# EAGLE design OSO-SWAT-A1-0x (EAGLE 9.4.2)
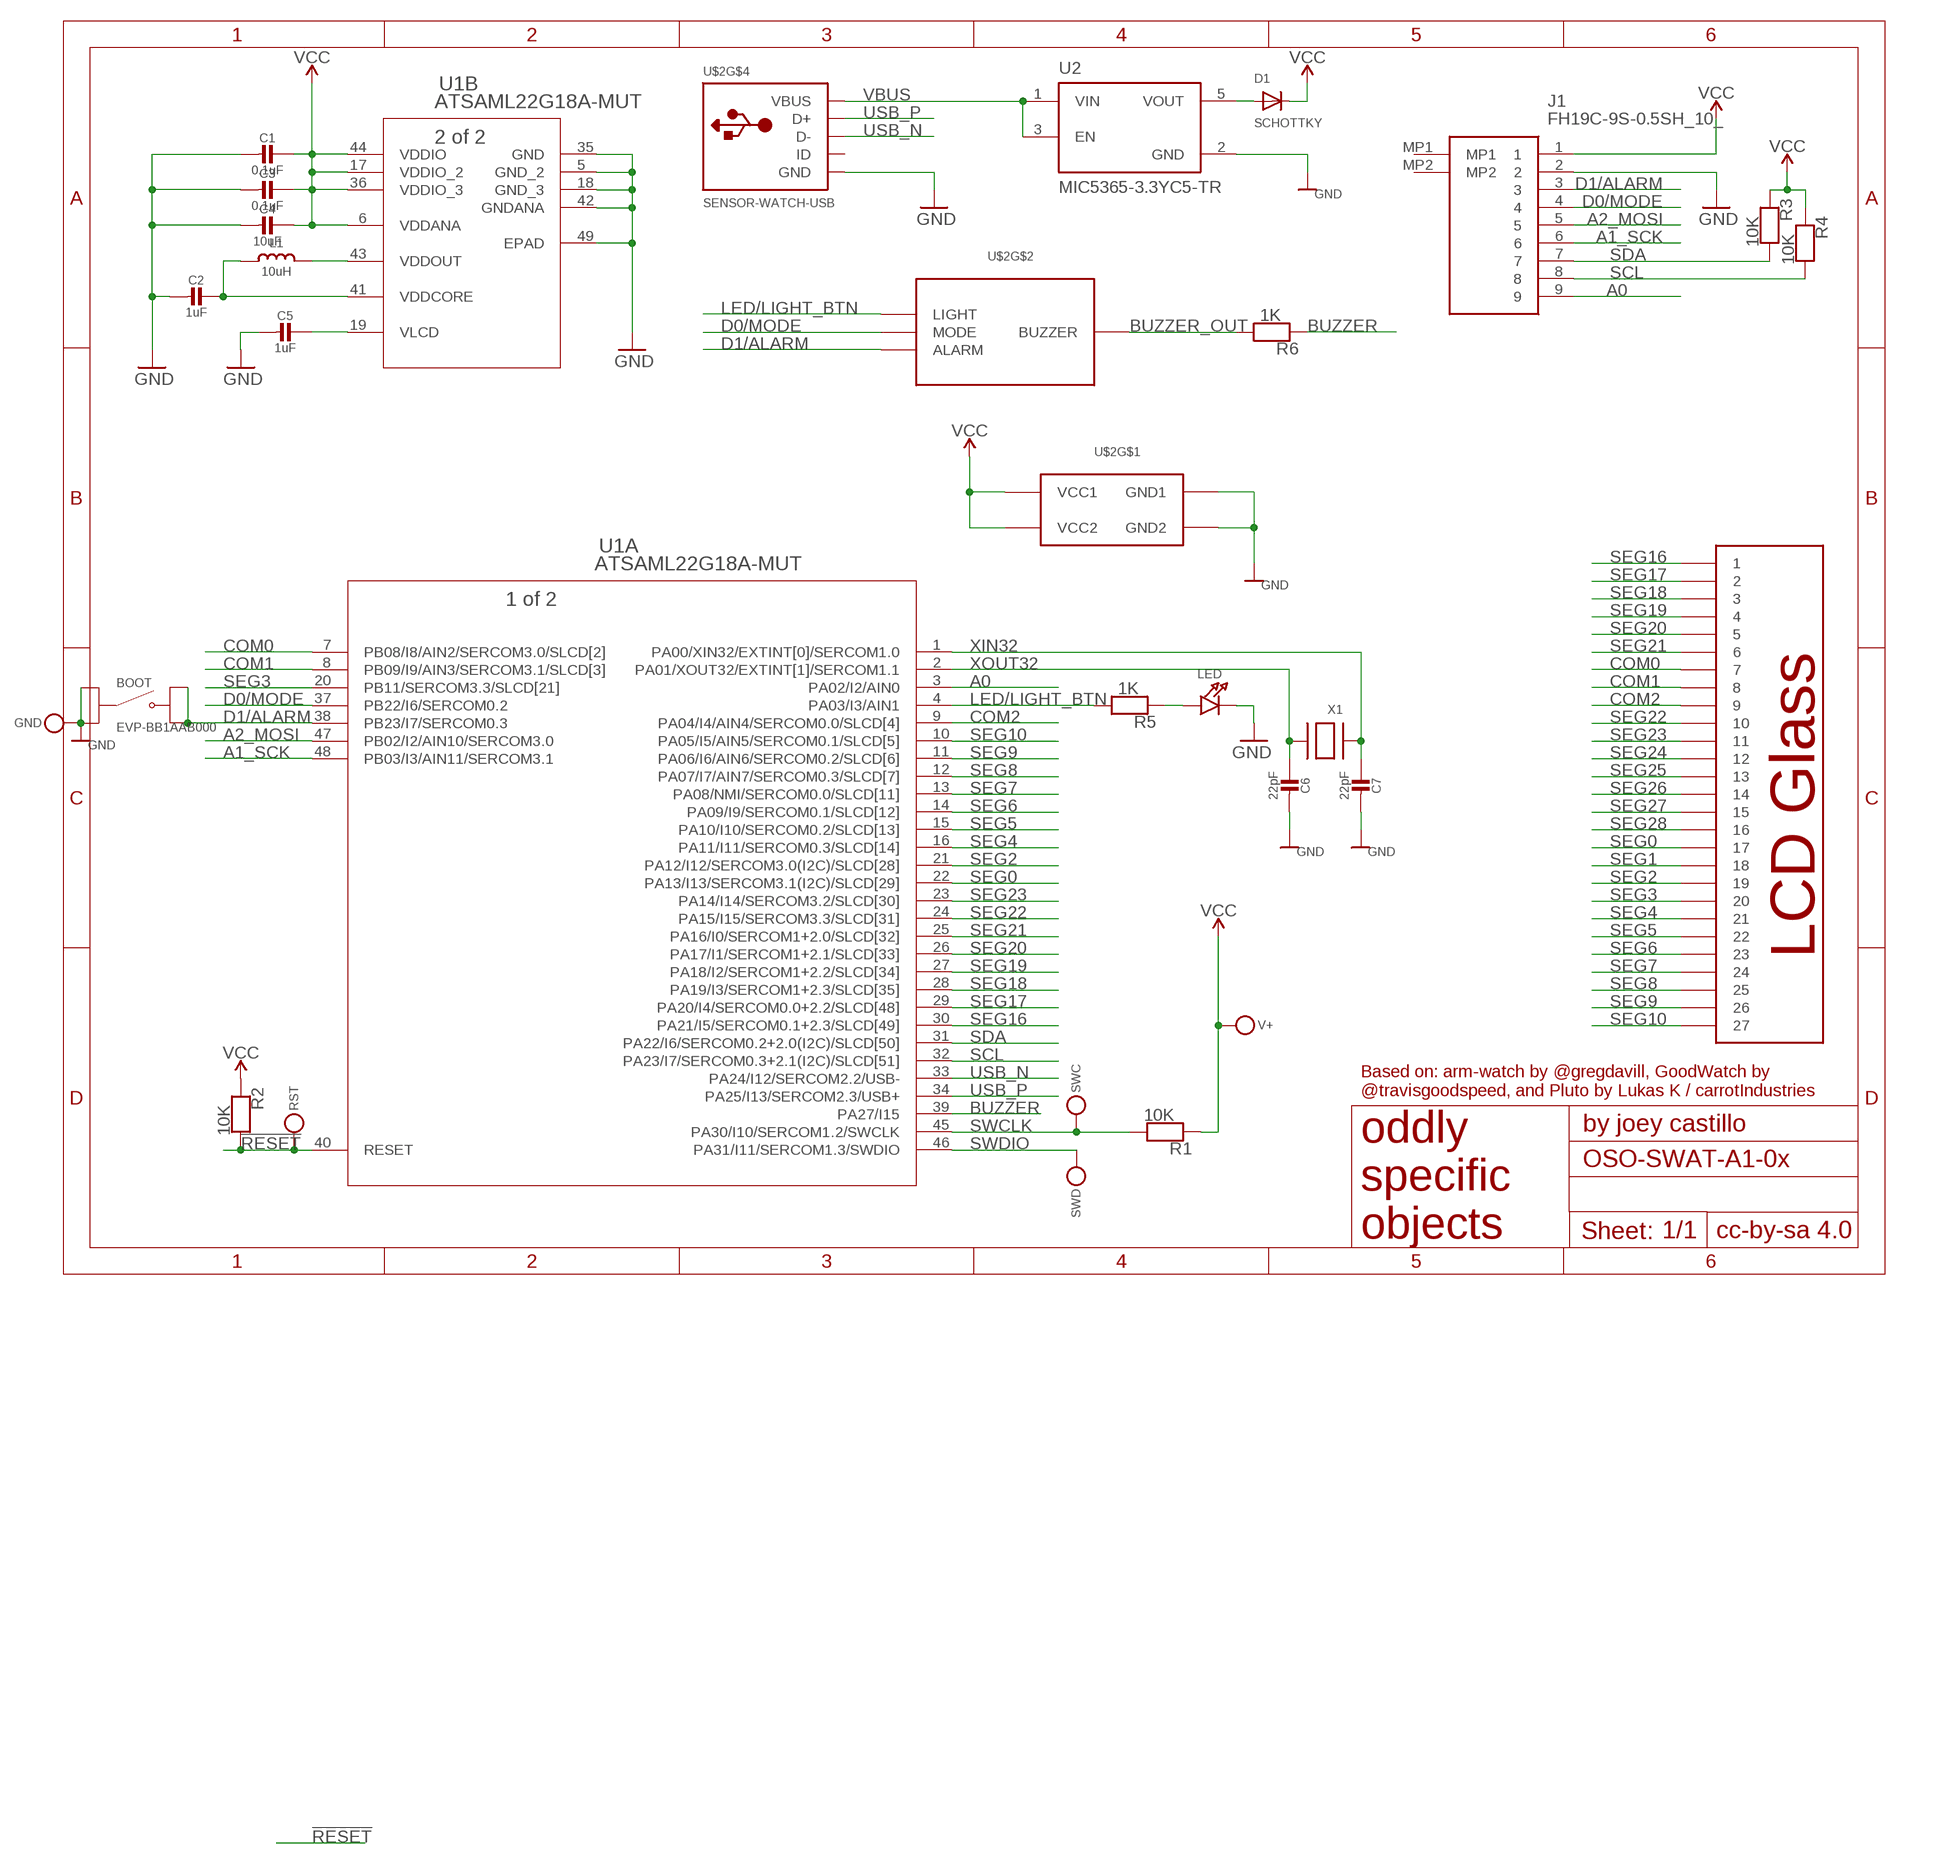
[diagram p0: schematic, sheet 1]

## Parts
BOOT  EVP-BB1AAB000  [SW_EVP-BB1AAB000]
C1  0.1uF  CAP_CERAMIC_0603MP  [_0603MP]
C2  1uF  CAP_CERAMIC_0603MP  [_0603MP]
C3  0.1uF  CAP_CERAMIC_0603MP  [_0603MP]
C4  10uF  CAP_CERAMIC_0603MP  [_0603MP]
C5  1uF  CAP_CERAMIC_0603MP  [_0603MP]
C6  22pF  CAP_CERAMIC_0603MP  [_0603MP]
C7  22pF  CAP_CERAMIC_0603MP  [_0603MP]
D1  SCHOTTKY  DIODESOD-323F  [SOD-323F]
GND  MICROBUILDER_TESTPOINTPAD1MM  [MICROBUILDER_TESTPOINT_PAD_1MM]
J1  FH19C-9S-0.5SH_10_  [FH19C9S05SH10]
L1  10uH  MICROBUILDER_INDUCTOR_0805MP  [MICROBUILDER__0805MP]
LED  LED0805_NOOUTLINE  [CHIPLED_0805_NOOUTLINE]
R1  10K  RESISTOR_0603MP  [_0603MP]
R2  10K  RESISTOR_0402MP  [_0402MP]
R3  10K  RESISTOR_0603MP  [_0603MP]
R4  10K  RESISTOR_0603MP  [_0603MP]
R5  1K  RESISTOR_0603MP  [_0603MP]
R6  1K  RESISTOR_0603MP  [_0603MP]
RST  MICROBUILDER_TESTPOINTPAD1MM  [MICROBUILDER_TESTPOINT_PAD_1MM]
SWC  MICROBUILDER_TESTPOINTPAD1MM  [MICROBUILDER_TESTPOINT_PAD_1MM]
SWD  MICROBUILDER_TESTPOINTPAD1MM  [MICROBUILDER_TESTPOINT_PAD_1MM]
U1  ATSAML22G18A-MUT  [QFN48_7X7MC_MCH]
U2  MIC5365-3.3YC5-TR  [SOT65P210X110-5N]
U$2  SENSOR-WATCH-USB  [CASIO-F91W-OUTLINE-USB]
V+  MICROBUILDER_TESTPOINTPAD1MM  [MICROBUILDER_TESTPOINT_PAD_1MM]
X1  XTAL-3.2X1.5  [XTAL3215]

## Nets
3.3V [power]: D1.A U2.5(VOUT)
!RESET: R2.2 RST.P$1 U1.40(A:RESET)
A0: J1.9 U1.3(A:PA02/I2/AIN0)
A1_SCK: J1.6 U1.48(A:PB03/I3/AIN11/SERCOM3.1)
A2_MOSI: J1.5 U1.47(A:PB02/I2/AIN10/SERCOM3.0)
BUZZER: R6.1 U1.39(A:PA27/I15)
BUZZER_OUT: R6.2 U$2.BUZZER
COM0: U1.7(A:PB08/I8/AIN2/SERCOM3.0/SLCD[2]) U$2.7
COM1: U1.8(A:PB09/I9/AIN3/SERCOM3.1/SLCD[3]) U$2.8
COM2: U1.9(A:PA04/I4/AIN4/SERCOM0.0/SLCD[4]) U$2.9
D0/MODE: J1.4 U1.37(A:PB22/I6/SERCOM0.2) U$2.MODE
D1/ALARM: BOOT.B1 BOOT.B2 J1.3 U1.38(A:PB23/I7/SERCOM0.3) U$2.ALARM
GND [gnd]: BOOT.A1 BOOT.A2 C1.2 C2.2 C3.2 C4.2 C5.2 C6.2 C7.2 GND.P$1 J1.2 LED.C U1.5(B:GND_2) U1.18(B:GND_3) U1.35(B:GND) U1.42(B:GNDANA) U1.49(B:EPAD) U2.2(GND) U$2.GND U$2.GND1 U$2.GND2
LED/LIGHT_BTN: R5.2 U1.4(A:PA03/I3/AIN1) U$2.LIGHT
N$1: LED.A R5.1
SCL: J1.8 R4.2 U1.32(A:PA23/I7/SERCOM0.3+2.1(I2C)/SLCD[51])
SDA: J1.7 R3.2 U1.31(A:PA22/I6/SERCOM0.2+2.0(I2C)/SLCD[50])
SEG0: U1.22(A:PA13/I13/SERCOM3.1(I2C)/SLCD[29]) U$2.17
SEG1: U$2.18
SEG2: U1.21(A:PA12/I12/SERCOM3.0(I2C)/SLCD[28]) U$2.19
SEG3: U1.20(A:PB11/SERCOM3.3/SLCD[21]) U$2.20
SEG4: U1.16(A:PA11/I11/SERCOM0.3/SLCD[14]) U$2.21
SEG5: U1.15(A:PA10/I10/SERCOM0.2/SLCD[13]) U$2.22
SEG6: U1.14(A:PA09/I9/SERCOM0.1/SLCD[12]) U$2.23
SEG7: U1.13(A:PA08/NMI/SERCOM0.0/SLCD[11]) U$2.24
SEG8: U1.12(A:PA07/I7/AIN7/SERCOM0.3/SLCD[7]) U$2.25
SEG9: U1.11(A:PA06/I6/AIN6/SERCOM0.2/SLCD[6]) U$2.26
SEG10: U1.10(A:PA05/I5/AIN5/SERCOM0.1/SLCD[5]) U$2.27
SEG16: U1.30(A:PA21/I5/SERCOM0.1+2.3/SLCD[49]) U$2.1
SEG17: U1.29(A:PA20/I4/SERCOM0.0+2.2/SLCD[48]) U$2.2
SEG18: U1.28(A:PA19/I3/SERCOM1+2.3/SLCD[35]) U$2.3
SEG19: U1.27(A:PA18/I2/SERCOM1+2.2/SLCD[34]) U$2.4
SEG20: U1.26(A:PA17/I1/SERCOM1+2.1/SLCD[33]) U$2.5
SEG21: U1.25(A:PA16/I0/SERCOM1+2.0/SLCD[32]) U$2.6
SEG22: U1.24(A:PA15/I15/SERCOM3.3/SLCD[31]) U$2.10
SEG23: U1.23(A:PA14/I14/SERCOM3.2/SLCD[30]) U$2.11
SEG24: U$2.12
SEG25: U$2.13
SEG26: U$2.14
SEG27: U$2.15
SEG28: U$2.16
SWCLK: R1.2 SWC.P$1 U1.45(A:PA30/I10/SERCOM1.2/SWCLK)
SWDIO: SWD.P$1 U1.46(A:PA31/I11/SERCOM1.3/SWDIO)
USB_N: U1.33(A:PA24/I12/SERCOM2.2/USB-) U$2.USB_N(D-)
USB_P: U1.34(A:PA25/I13/SERCOM2.3/USB+) U$2.USB_P(D+)
VBUS: U2.1(VIN) U2.3(EN) U$2.VBUS
VCC [power]: C1.1 C3.1 C4.1 D1.C J1.1 R1.1 R2.1 R3.1 R4.1 U1.6(B:VDDANA) U1.17(B:VDDIO_2) U1.36(B:VDDIO_3) U1.44(B:VDDIO) U$2.VCC1 U$2.VCC2 V+.P$1
VDDCORE: C2.1 L1.1 U1.41(B:VDDCORE)
VDDOUT: L1.2 U1.43(B:VDDOUT)
VLCD: C5.1 U1.19(B:VLCD)
XIN32: C7.1 U1.1(A:PA00/XIN32/EXTINT[0]/SERCOM1.0) X1.P$1
XOUT32: C6.1 U1.2(A:PA01/XOUT32/EXTINT[1]/SERCOM1.1) X1.P$2
Unconnected: J1.MP1 J1.MP2 U$2.USB_ID(ID)

## Notes on the sheet
- Based on: arm-watch by @gregdavill, GoodWatch by 
  @travisgoodspeed, and Pluto by Lukas K / carrotIndustries

## Library data of the parts
BOOT = EVP-BB1AAB000:EVP-BB1AAB000: SWITCH TACTILE SPST-NO 0.02A 15V; DESCRIPTION: Tactile Switch SPST-NO Top Actuated Surface Mount; DIGI-KEY_PART_NUMBER: P124390CT-ND; MF: Panasonic Electronic Components; MP: EVP-BB1AAB000; PACKAGE: None; PURCHASE-URL: https://pricing.snapeda.com/search/part/EVP-BB1AAB000/?ref=eda
C1-C7 = microbuilder:CAP_CERAMIC: Ceramic Capacitors For new designs, use the packages preceded by an '_' character since they are more reliable: The following footprints should be used on most boards: _0402 - Standard footprint for regular board layouts _0603 - Standard footprint for regular board layouts _0805 - Standard footprint for regular board layouts _1206 - Standard footprint for regular board layouts For extremely tight-pitch boards where space is at a premium, the following 'micro-pitch' footprints can be used (smaller pads, no silkscreen outline, etc.): _0402MP - Micro-pitch footprint for very dense/compact boards _0603MP - Micro-pitch footprint for very dense/compact boards _0805MP - Micro-pitch footprint for very dense/compact boards _1206MP - Micro-pitch footprint for very dense/compact boards
D1 = adafruit:DIODE: Diode SMADIODE - SMA Surface Mount Package 20V 1A Schottky Diode Digikey: 641-1014-6-ND DO-1N4148 - Through Hole Small Current Diode SOD-123 20V 1 A (.5mV Vf) Schottky Diode - Digikey: MBRX120TPMSCT-ND SOD-323 10V 570mA (.38mV Vf, 3ns) Schottky Diode - Digikey: ZLLS410CT-ND SOD-523 30V 30mA Schottky Diode (RB751S-40TE61) - Digikey: RB751S-40TE61CT-ND SOT23-R/W - SOT23 Package (R = Solder Paste/Reflow Ovens, W = Hand-Soldering) BAT54Film 40V 300mA - Digikey: 497-7162-1-ND
GND RST SWC SWD V+ = Adafruit Feather M0 Express:MICROBUILDER_TESTPOINT: Test Point Various test points for characterisation and PCB testing TESTPOINT_SMT - Compact Surface Mount Test Point [Digikey: 5016KTR-ND]
J1 = FH19C-9S-0.5SH:FH19C-9S-0.5SH_10_: CONN FFC BOTTOM 9POS 0.50MM R/A Source: Datasheet <https://componentsearchengine.com/Datasheets/1/FH19C-9S-0.5SH(10).pdf>; DESCRIPTION: CONN FFC BOTTOM 9POS 0.50MM R/A; HEIGHT: 1mm; MANUFACTURER_NAME: Hirose; MANUFACTURER_PART_NUMBER: FH19C-9S-0.5SH(10); MOUSER_PART_NUMBER: 798-FH19C9S05SH10; MOUSER_PRICE-STOCK: https://www.mouser.co.uk/ProductDetail/Hirose-Connector/FH19C-9S-05SH10?qs=vnk2wBG9e15bX8eK%2FvDSMA%3D%3D
L1 = Adafruit 3.5in 480x320 FeatherWing:MICROBUILDER_INDUCTOR: Inductors 0603: 10nH Ceramic Inductor - microwire antenna/RF (Digikey: 712-1434-2-ND) 0805: 560nH Ceramic Inductor - RF (Digikey: 553-1047-1-ND) 270nH Ceramic Inductor - Q = 40@250MHz, +-5%, 1 Ohm DC Resistance (Digikey: 535-10506-2-ND) 1007 (2518 Metric) SMT: 10µH 10% 250mOhm 820mA 1007 Inductor (Digikey: 587-2189-1-ND) 22µH 10% 500mOhm 580mA 1007 Inductor (Digikey: 587-2190-1-ND) 47µH 10% 950mOhm 420mA 1007 Inductor (Digikey: 587-2191-1-ND) 47µH 5% 100mOhm 1A 1008 Inductor (Digikey: 732-1816-1-ND) 5.0x5.0mm (Taiyo Yuden NR5040 Series) 6.8µH 20% 2.3A 64mOhm Inductor (Digikey: 587-2374-2-ND) 5.0x5.0mm (TDK VLC5045 Series) 4.7µH 20% 3.3A 34mOhm Inductor (Digikey: 445-6526-1-ND) 6.8µH 20% 2.7A 46mOhm Inductor (Digikey: 445-6527-1-ND) 6.0x6.0mm (TDK VLC6045 Series) 4.7µH 20% 3.8A 27mOhm Inductor (Digikey: 445-6538-2-ND) 6.8µH 20% 3A 41mOhm Inductor (Digikey: 445-6540-1-ND) 6.2µH 30% 2.2A 45mOhm Inductor (Digikey: SRR5028-6R2YCT-ND) - Not TDK VLC6045 but footprint should match 6.0x6.0mm (TDK SLF6045 Series) 6.8uH 30% 2A 33mOhm Inductor (Digikey: 445-4572-1-ND, Mouser: 810-SLF645T6R8N2R0PF) 6.0x6.0mm (Sumida CDRH5D28 Series) 6.2uH 30% 1.8A 45mOhm Inductor (Digikey: 308-1542-1-ND) Taiyo Yuden NR3015T2R2M - 2.2uH 20% 1.5A (Digikey: 587-1648-2-ND, Mouser: 963-NR3015T2R2M) - Used with TI TPS62172 CoilCraft RFID Transponder Coil - MA5532-AE (For use with AS3935 Lightning Sensor) Taiyo Yuden NRH2412T2R2MNGH - 2.2uH 20% 1AA (Digikey: 587-3443-1-ND) - Used with TI LM3671 Vishay IHLP 1.0uH Molded Inductor - 24mOhm DCR, 5A, +/-20%, -55°C-125°C (Digikey: 541-1319-1-ND)
LED = My Stuff:LED: LED 0603 - 0603 Surface Mount Package 2mA: Green LED - Low Power (3.9mcd, 2ma, 1.7Vf) - Digikey: 475-2709-2-ND Orange LED - Low Power (9.8mcd, 2ma, 1.8Vf) - Digikey: 475-1194-2-ND Red LED - Low Power (5mcd, 2ma, 1.8Vf) - Digikey: 475-1195-2-ND Yellow LED - Low Power (7mcd, 2ma, 1.8Vf) - Digikey: 475-1196-2-ND 5mA: Blue LED - Low Power (17mcd, 5ma, 2.9Vf) - Digikey: LNJ937W8CRACT-ND 0805 - 0805 Surface Mount Package 2mA: Red LED (8.8mcd, 2mA, 1.8Vf, Clear) - Low Power [Digikey: 475-2510-1-ND] Green LED (5mcd, 2mA, 1.8Vf, Clear) - Low Power [Digikey: 475-2730-1-ND] Yellow LED (11.3mcd, 2mA, 1.8Vf, Clear) - Low Power [Digikey: 475-2555-1-ND] 20mA: Red LED (104mcd, 20mA, Diffused) - LS R976 [Digikey: 475-1278-6-ND] Red LED (12mcd, 20mA, 2.0Vf, Clear) - APT2012EC [Digikey: 754-1128-1-ND] Green LED (15mcd, 20mA, 2.2Vf, Clear) - APT2012GC [Digikey: 754-1131-1-ND] Orange LED (160mcd, 20mA, 2.1Vf, Clear) - APT2012SECK [Digikey: 754-1130-1-ND] 1206 - 1206 Surface Mount Package Green LED (26mcd, 20mA, Diffused) - LG N971 [Digikey: 475-1407-6-ND] Red LED (15mcd, 20mA, Diffused) - LH N974 [Digikey: 475-1416-6-ND] Cree - Cree High-Power Surface Mount LEDs XPEBWT-L1-0000-00D50 - White 111lm 350mA 2.9Vf 6200K 110° XTEAWT-00-0000-00000LEE3 - White 114lm 350mA 2.85Vf 5000K 115° Everlight - Everlight 45-21 Series Surface Mount LEDs 45-21/QK2C-B2832AC2CB2/2T - Warm White 2000mcd 20mA 3.25Vf 3050K 120° 45-21/LK2C-B38452C4CB2/2T - Nuetral White 2000mcd 20mA 3.25Vf 4150K 120° 45-21/LK2C-B50634C6CB2/2T - Cold White 2200mcd 20mA 3.25Vf 5650K 120° PLCC2 Reverse Mount LS T77K-J1L2-1-0-2-R18-Z - Red 11.25mcd 2mA 1.8Vf 630nm 120° LO T77K-L1M2-24-Z - Orange 19.6mcd 2mA 1.8Vf 606nm 120° LY T77K-K2M1-26-Z - Yellow 15.7mcd 2mA 1.8Vf 587nm 120°
R1-R6 = microbuilder:RESISTOR: Resistors For new designs, use the packages preceded by an '_' character since they are more reliable: The following footprints should be used on most boards: _0402 - Standard footprint for regular board layouts _0603 - Standard footprint for regular board layouts _0805 - Standard footprint for regular board layouts _1206 - Standard footprint for regular board layouts For extremely tight-pitch boards where space is at a premium, the following 'micro-pitch' footprints can be used (smaller pads, no silkscreen outline, etc.): _0402MP - Micro-pitch footprint for very dense/compact boards _0603MP - Micro-pitch footprint for very dense/compact boards _0805MP - Micro-pitch footprint for very dense/compact boards _1206MP - Micro-pitch footprint for very dense/compact boards
U1 = ATSAML22G18A-MUT:ATSAML22G18A-MUT; BUILT_BY: EMA_Molly; COPYRIGHT: Copyright (C) 2018 Accelerated Designs. All rights reserved; MANUFACTURER_PART_NUMBER: ATSAML22G18A-MUT; SOURCELIBRARY: Microchip_2019-08-23_25; VENDOR: Microchip
U2 = MIC5365-3.3YC5-TR:MIC5365-3.3YC5-TR: Linear Voltage Regulator IC 1 Output 150mA SC-70-5; DESCRIPTION: Linear Voltage Regulator IC 1 Output 150mA SC-70-5; DIGI-KEY_PART_NUMBER: 576-3193-1-ND; MF: Microchip; MP: MIC5365-3.3YC5-TR; PACKAGE: SC-70-5 Microchip; PURCHASE-URL: https://pricing.snapeda.com/search/part/MIC5365-3.3YC5-TR/?ref=eda
U$2 = My Stuff:SENSOR-WATCH-USB
X1 = adafruit:XTAL: Low cost SMT crystals, no capacitors included http://www.ladyada.net/library/eagle

## Net classes
0 default: width 0.102 mm
1 power: width 0.254 mm
2 gnd: width 0.254 mm

## Board
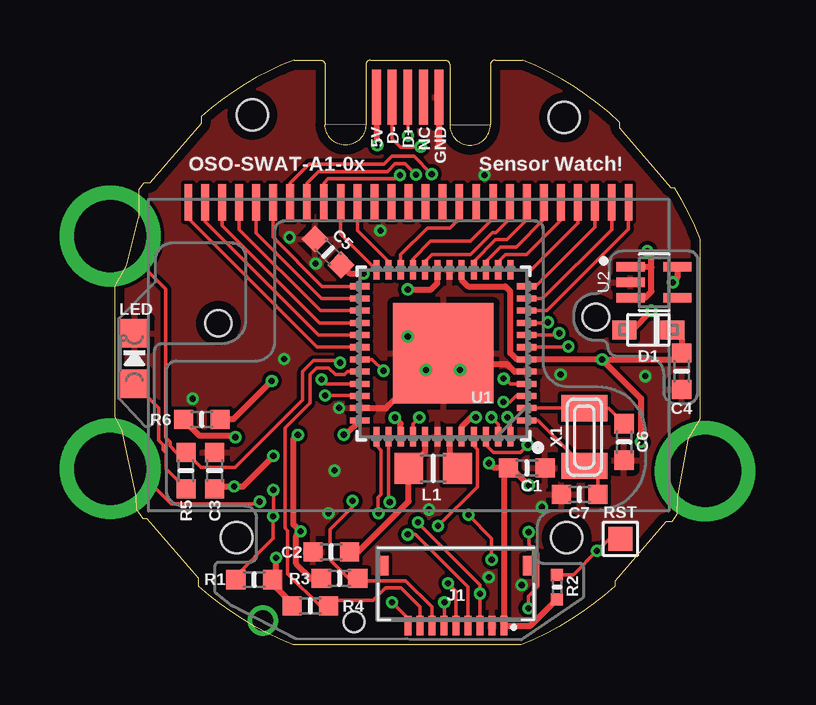
[diagram p1: board, top side]
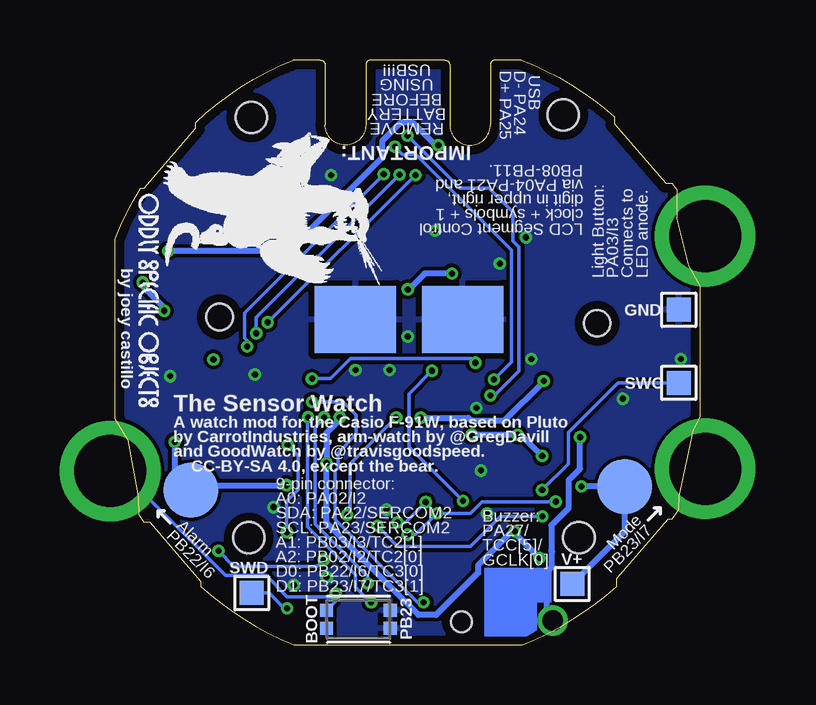
[diagram p2: board, bottom side, seen from below]

Size 24.4 x 24.38 mm. Coordinates in mm from the lower left corner, seen from the top.
Copper layers (1*16): Top 0.035559375mm / dielectric 1.6mm / Bottom 0.035559375mm
Design rules "oshpark-2layer *": minimum track width 6mil, minimum drill 10mil, track to track 6mil, track to pad 6mil, pad to pad 6mil, via to via 6mil, smd to smd 6mil, copper to edge 15mil, drill to drill 6mil, minimum pad ring 5mil, minimum via ring 5mil, stop-mask expansion 2.5mil, vias tented up to drill 10mil, thermal gap 10mil

### Footprints (pad centres in the part's own frame; a part is rotated, then mirrored left to right if it is on the bottom)
SW_EVP-BB1AAB000 = smd 0.55 x 0.55: A1 -1.325,0.375; A2 -1.325,-0.375; B1 1.325,0.375; B2 1.325,-0.375
_0603MP = smd 0.8 x 0.8: 1 -0.762,0; 2 0.762,0
SOD-323F = smd 1 x 0.8: A -1,0; C 1,0
MICROBUILDER_TESTPOINT_PAD_1MM = smd 1 x 1: P$1 0,0
FH19C9S05SH10 = smd 0.3 x 0.8: 1 -2,2.5; 2 -1.5,2.5; 3 -1,2.5; 4 -0.5,2.5; 5 0,2.5; 6 0.5,2.5; 7 1,2.5; 8 1.5,2.5; 9 2,2.5 | smd 0.4 x 0.8: MP1 -3,0; MP2 3,0
MICROBUILDER__0805MP = smd 1.2 x 1.3: 1 -1.016,0; 2 1.016,0
CHIPLED_0805_NOOUTLINE = smd 1.2 x 1.2: A 0,-1.05; C 0,1.05
_0402MP = smd 0.5 x 0.5: 1 -0.508,0; 2 0.508,0
QFN48_7X7MC_MCH = smd 0.813 x 0.254: 1 -3.48,2.794; 2 -3.48,2.286; 3 -3.48,1.778; 4 -3.48,1.27; 5 -3.48,0.762; 6 -3.48,0.254; 7 -3.48,-0.254; 8 -3.48,-0.762; 9 -3.48,-1.27; 10 -3.48,-1.778; 11 -3.48,-2.286; 12 -3.48,-2.794; 25 3.48,-2.794; 26 3.48,-2.286; 27 3.48,-1.778; 28 3.48,-1.27; 29 3.48,-0.762; 30 3.48,-0.254; 31 3.48,0.254; 32 3.48,0.762; 33 3.48,1.27; 34 3.48,1.778; 35 3.48,2.286; 36 3.48,2.794 | smd 0.254 x 0.813: 13 -2.794,-3.48; 14 -2.286,-3.48; 15 -1.778,-3.48; 16 -1.27,-3.48; 17 -0.762,-3.48; 18 -0.254,-3.48; 19 0.254,-3.48; 20 0.762,-3.48; 21 1.27,-3.48; 22 1.778,-3.48; 23 2.286,-3.48; 24 2.794,-3.48; 37 2.794,3.48; 38 2.286,3.48; 39 1.778,3.48; 40 1.27,3.48; 41 0.762,3.48; 42 0.254,3.48; 43 -0.254,3.48; 44 -0.762,3.48; 45 -1.27,3.48; 46 -1.778,3.48; 47 -2.286,3.48; 48 -2.794,3.48 | smd 4.191 x 4.191: 49 0,0
SOT65P210X110-5N = smd 1.17 x 0.4: 1 -0.97,0.65; 2 -0.97,0; 3 -0.97,-0.65; 4 0.97,-0.65; 5 0.97,0.65
CASIO-F91W-OUTLINE-USB = smd 0.326 x 1.52: 1 -9.148,6.25; 2 -8.442,6.25; 3 -7.736,6.25; 4 -7.03,6.25; 5 -6.324,6.25; 6 -5.618,6.25; 7 -4.912,6.25; 8 -4.206,6.25; 9 -3.5,6.25; 10 -2.794,6.25; 11 -2.088,6.25; 12 -1.382,6.25; 13 -0.676,6.25; 14 0.03,6.25; 15 0.736,6.25; 16 1.442,6.25; 17 2.148,6.25; 18 2.854,6.25; 19 3.56,6.25; 20 4.266,6.25; 21 4.972,6.25; 22 5.678,6.25; 23 6.384,6.25; 24 7.09,6.25; 25 7.796,6.25; 26 8.502,6.25; 27 9.208,6.25 | drill 3 pad 4.2: ALARM 12.4,-4.95; LIGHT -12.4,4.85; MODE -12.4,-4.85 | drill 0.85 pad 1.2: BUZZER -6.045,-11.176 | smd 0.37 x 2.3: GND 1.3,10.644; USB_ID 0.65,10.644; USB_N -0.65,10.644; USB_P 0,10.644; VBUS -1.3,10.644 | smd 3.404 x 2.794 bottom: GND1 -2.286,1.372; GND2 2.184,1.372 | smd 2.286 x 2.286 bottom: VCC1 -9.042,-5.588; VCC2 9.042,-5.74 | hole 0.85: -2.235,-11.227 | hole 1.1: -7.899,1.219; 7.849,1.473 | hole 1.3: -6.477,9.906; 6.528,9.804; 6.629,-7.722; -7.137,-7.722
XTAL3215 = smd 1.1 x 1.9: P$1 1.2,0; P$2 -1.2,0

### Placement (x,y rotation side)
BOOT  14.26,1.06 180 bottom
C1  17.17,7.37 0 top
C2  9.01,3.87 180 top
C3  4.15,7.26 90 top
C4  23.62,11.4 270 top
C5  8.88,16.38 135 top
C6  21.22,8.45 270 top
C7  19.36,6.27 180 top
D1  22.23,13.13 0 top
GND  0.9,13.96 0 bottom
J1  14.21,3.3 180 top
L1  13.25,7.35 0 top
LED  0.81,11.93 0 top
R1  5.8,2.71 180 top
R2  18.42,2.41 90 top
R3  9.36,2.76 0 top
R4  8.14,1.62 0 top
R5  2.95,7.26 90 top
R6  3.61,9.39 180 top
RST  21.06,4.41 0 top
SWC  0.9,10.92 0 bottom
SWD  18.7,2.15 0 bottom
U1  13.69,12.15 180 top
U2  22.46,15.11 0 top
U$2  12.2,12.19 0 top
U$5  [OSO_BEAR_250X360MIL_1000DPI]  17.79,18.15 270 bottom
U$6  [OSO_WORDMARK_ONELINE_350MIL_1000DPI]  22.99,14.34 270 bottom
V+  5.34,2.53 0 bottom
X1  19.57,8.66 270 top

### Tracks (layer width: path | path; a pad name or v marks a point on that pad's centre or on a via)
3.3V  (via drill 0.25)
  Top 0.254: U2.5 23.43,15.29 v23.25,15.11 | D1.A 21.56,13.13 v22.36,13.92
  Bottom 0.254: v22.36,13.92 22.36,14.07 23.25,14.95 v23.25,15.11
!RESET  (via drill 0.25)
  Top 0.152: U1.40 12.42,9.2 v12.68,9.47 | v14.73,5.41 15.7,4.44 v15.7,3.54 | RST.P$1 20.6,4.41 v20.09,3.91 19.1,2.91 R2.2
  Bottom 0.152: v12.68,9.47 14.61,7.54 14.61,5.52 v14.73,5.41 | v15.7,3.54 15.97,3.27 19.45,3.27 v20.09,3.91
A0  (via drill 0.25)
  Top 0.152: v11.54,1.77 12.21,1.1 J1.9 | v16.19,10.12 16.46,10.12 16.71,10.37 U1.3
  Bottom 0.152: v16.19,10.12 14.89,10.12 14.35,9.58 14.35,8.76 15.11,7.99 15.11,7.37 15.23,7.24 15.23,5.22 11.79,1.77 v11.54,1.77
A1_SCK  (via drill 0.25)
  Top 0.152: U1.48 16.48,9.32 16.35,9.45 v16.35,9.48 | v13.72,1.77 13.72,0.81 J1.6
  Bottom 0.152: v16.35,9.48 16.38,9.46 16.38,4.91 14.38,2.91 14.38,2.38 13.77,1.77 v13.72,1.77
A2_MOSI  (via drill 0.25)
  Top 0.152: J1.5 14.21,2.23 v13.88,2.56 | v15.69,9.48 15.69,9.45 15.97,9.18 U1.47
  Bottom 0.152: v13.88,2.56 13.88,2.84 16.07,5.03 16.07,9.07 15.69,9.45 v15.69,9.48
BUZZER  (via drill 0.25)
  Top 0.254: U1.39 11.91,9.22 v11.66,9.46 | v6.53,11 4.92,9.39 R6.1
  Bottom 0.254: v11.66,9.46 9.67,9.46 9.55,9.34 8.16,9.34 6.53,10.97 v6.53,11
BUZZER_OUT  (via drill 0.25)
  Top 0.254: v5.01,8.65 4.96,8.71 3.51,8.71 2.85,9.37 R6.2
  Bottom 0.254: U$2.BUZZER 6.41,1.26 6.41,3.02 6.18,3.24 6.18,3.88 6.22,3.92 6.22,4.96 5.5,5.69 5.5,6.85 5.01,7.33 v5.01,8.65
COM0  (via drill 0.25)
  Top 0.152: U1.7 18.87,12.4 v18.89,12.43 | v13.2,19.62 12.46,20.37 11.55,20.37 11.22,20.04 8.09,20.04 7.29,19.24 U$2.7
  Bottom 0.152: v13.2,19.62 19,13.82 19,12.78 18.89,12.68 v18.89,12.43
COM1  (via drill 0.25)
  Top 0.152: U1.8 18.44,12.91 v18.52,12.98 | v12.54,19.6 12.08,20.06 11.68,20.06 11.35,19.73 8.48,19.73 7.99,19.25 U$2.8
  Bottom 0.152: v18.52,12.98 18.52,13.23 18.52,13.24 18.52,13.64 15.96,16.21 15.93,16.21 v12.54,19.6
COM2  (via drill 0.25)
  Top 0.152: U1.9 18.02,13.42 v18.04,13.44 | v11.88,19.58 11.72,19.43 8.88,19.43 8.7,19.25 U$2.9
  Bottom 0.152: v11.88,19.58 18.01,13.44 v18.04,13.44
D0/MODE  (via drill 0.25)
  Top 0.152: J1.4 14.71,2.41 12.53,4.59 v12.2,4.59 | v10.98,5.48 10.96,5.5 10.96,6.14 11.09,6.27 11.09,8.11 10.89,8.31 U1.37 | v6.03,5.96 5.93,5.87 2.33,5.87 0.86,7.34 U$2.MODE
  Bottom 0.152: v12.2,4.59 11.87,4.59 v10.98,5.48 9.58,5.48 9.1,5.96 v6.03,5.96
D1/ALARM  (via drill 0.25)
  Top 0.152: v11.45,5.94 11.4,5.99 U1.38 | v12.62,5.1 12.62,5.07 15.21,2.49 v15.21,2.13 J1.3
  Bottom 0.152: v11.45,5.94 12.29,5.1 v12.62,5.1 | U$2.ALARM 24.14,7.24 19.79,2.88 18.11,2.88 17.23,2 15.33,2 v15.21,2.13 15.21,1.81 BOOT.B2 BOOT.B1
GND  (via drill 0.25)
  Top 0.254: U$2.GND 13.5,20.85 | v14.38,11.45 14.63,11.69 16.35,11.69 16.66,11.39 U1.5 | U1.35 11.3,9.86 12.89,11.45 v12.96,11.45
  other vias: 12.2,12.85 9.33,9.87 0.82,11.91 9.15,7.26 8.9,5.48 15.58,2.81 17.79,5.73 15.4,19.58 18.58,11.27 7.04,11.91 7.27,16.99 8.36,15.89 13.09,5.63 11.06,17.27 22.11,11.2 16.95,2.48 3.23,10.26
  pour Top: 7.37,24.38 17.03,24.38 19.57,23.11 21.09,21.84 23.38,19.04 24.39,17.01 24.39,9.39 23.38,5.33 20.84,2.28 18.3,0.5 17.03,-0.01 7.37,-0.01 5.09,1.01 3.56,2.28 1.02,5.33 0.01,9.39 0.01,14.98 1.02,19.04 3.56,22.09 5.85,23.62
  pour Bottom: 17.03,24.38 7.37,24.38 4.83,23.11 3.31,21.84 1.02,19.04 0.01,17.01 0.01,9.01 0.9,5.45 3.51,2.32 6.1,0.5 7.37,-0.01 17.03,-0.01 19.31,1.01 20.84,2.28 23.38,5.33 24.39,9.39 24.39,17.82 20.84,22.09 18.55,23.62
LED/LIGHT_BTN  (via drill 0.25)
  Top 0.152: U$2.LIGHT -0.15,17.09 2.12,14.82 2.12,8.64 2.3,8.45 2.3,8.28 2.55,8.02 R5.2 3.59,7.38 5,7.38 7.82,10.21 7.82,11.38 8.28,11.84 9.29,11.84 v9.38,11.75 | U1.4 16.49,10.88 16.27,11.09 v16.2,11.09
  Bottom 0.152: v16.2,11.09 15.42,11.09 14.58,11.93 9.56,11.93 v9.38,11.75
N$1
  Top 0.152: R5.1 2.13,7.32 2.13,7.99 1.99,8.12 1.99,8.33 1.81,8.51 1.81,9.88 LED.A
SCL
  Top 0.152: J1.8 12.71,1.57 11.91,2.36 11.27,2.36 10.75,1.84 9.12,1.84 R4.2 8.54,1.62 7.2,2.96 7.2,4.75 7.08,4.87 7.08,9.04 8.12,10.08 8.12,11.26 8.41,11.54 8.91,11.54 9.19,11.26 9.57,11.26 9.7,11.39 U1.32
SDA  (via drill 0.25)
  Top 0.152: J1.7 13.21,1.58 12.12,2.67 10.21,2.67 R3.2 9.74,2.76 8.96,3.54 8.96,4.8 9.9,5.74 v9.9,5.99 | v11.18,11.42 10.71,11.89 U1.31
  Bottom 0.152: v11.18,11.42 12.14,10.46 12.14,8.24 v9.9,5.99
SEG0
  Top 0.152: U1.22 11.91,16.26 13.03,17.38 13.96,17.38 14.35,17.76 U$2.17
SEG2
  Top 0.152: U1.21 12.42,16.08 13.15,16.82 14.81,16.82 15.76,17.77 U$2.19
SEG3
  Top 0.152: U1.20 12.92,15.98 13.21,16.26 14.81,16.26 15.74,17.19 15.88,17.19 16.47,17.77 U$2.20
SEG4
  Top 0.152: U1.16 14.96,15.98 15.86,16.88 16.34,16.88 17.17,17.72 U$2.21
SEG5
  Top 0.152: U1.15 15.46,15.98 16.06,16.58 16.72,16.58 17.88,17.74 U$2.22
SEG6
  Top 0.152: U1.14 15.97,15.98 16.26,16.27 17.15,16.27 18.58,17.71 U$2.23
SEG7
  Top 0.152: U1.13 17.34,15.63 19.29,17.57 U$2.24
SEG8
  Top 0.152: U1.12 17.52,14.94 20,17.42 U$2.25
SEG9
  Top 0.152: U1.11 17.82,14.43 20.7,17.31 U$2.26
SEG10
  Top 0.152: U1.10 18,13.93 21.41,17.33 U$2.27
SEG16
  Top 0.152: U$2.1 3.05,17.78 8.43,12.4 U1.30
SEG17
  Top 0.152: U$2.2 3.76,17.63 8.48,12.91 U1.29
SEG18
  Top 0.152: U$2.3 4.46,17.48 8.53,13.42 U1.28
SEG19
  Top 0.152: U$2.4 5.17,17.31 8.56,13.93 U1.27
SEG20
  Top 0.152: U$2.5 5.88,17.16 8.61,14.43 U1.26
SEG21
  Top 0.152: U$2.6 6.58,16.99 8.63,14.94 U1.25
SEG22
  Top 0.152: U$2.10 9.41,17.11 U1.24
SEG23
  Top 0.152: U1.23 11.4,15.98 11.39,15.98 10.11,17.26 U$2.11
SWCLK  (via drill 0.25)
  Top 0.152: U1.45 14.96,8.29 15.1,8.14 15.1,6.59 v13.46,4.95 | R1.2 5.04,2.87 6.59,4.42 v6.59,5.35 v6.6,5.36 v6.6,6.45
  Bottom 0.152: v13.46,4.95 12.62,4.11 9.58,4.11 8.34,5.35 v6.59,5.35 | SWC.P$1 3.43,10.92 5.5,8.85 5.5,7.55 v6.6,6.45
SWDIO  (via drill 0.25)
  Top 0.152: U1.46 15.46,8.32 15.76,8.02 16.9,8.02 v17.2,8.32 | v17.23,1.52 17.23,2.03 17.63,2.43 17.63,3.79 17.24,4.18 v17.24,4.69
  Bottom 0.152: SWD.P$1 17.99,2.15 17.36,1.52 v17.23,1.52 | v17.24,4.69 17.24,5.98 16.77,6.45 16.77,7.89 v17.2,8.32
USB_N  (via drill 0.25)
  Top 0.152: U$2.USB_N 11.55,21.1 11.9,20.75 12.71,20.75 v12.74,20.77 | U1.33 8.78,10.88 v8.61,11.06
  Bottom 0.152: v12.74,20.77 12.41,20.44 11.85,20.44 7.87,16.46 7.87,11.79 v8.61,11.06
USB_P  (via drill 0.25)
  Top 0.152: U1.34 10.18,10.39 v8.76,10.39 | v12.21,21.23 v12.2,21.23 U$2.USB_P
  Bottom 0.152: v8.76,10.39 8.58,10.39 7.56,11.41 7.56,16.59 7.81,16.83 7.81,18.03 8.82,19.04 10.02,19.04 v12.21,21.23
VBUS  (via drill 0.25)
  Top 0.254: U$2.VBUS 10.9,20.85 v10.93,20.82 | U2.3 22.09,14.46 22.36,14.73 22.36,15.74 | v22.19,16.42 22.36,16.25 22.36,15.74 | U2.1 22.34,15.76 22.36,15.74
  Bottom 0.254: v10.93,20.82 11.04,20.82 11.98,21.76 12.5,21.76 13.27,20.99 13.27,20.3 17.16,16.42 v22.19,16.42
VCC  (via drill 0.25)
  Top 0.254: v20.3,11.89 U1.6 16.74,11.89 16.48,12.16 16.48,14.73 16.26,14.94 14.71,14.94 14.45,15.21 U1.17 | v15.03,9.48 14.84,9.48 14.45,9.09 U1.44 | v15.59,7.57 15.79,7.37 C1.1 | C1.1 16.23,7.2 16.23,0.82 J1.1 17.32,0.8 R2.1 | v20.3,11.89 21.92,10.27 v21.92,8.45 | v7.62,8.75 7.43,8.56 7.43,5.01 v7.73,4.72 7.55,4.54 7.55,3.37 8.16,2.76 R3.1 | v6.6,7.87 5.33,6.6 v4.96,6.6 4.25,6.6 C3.1 | v6.71,3.63 6.71,2.86 R1.1 6.56,2.53 7.37,1.72 R4.1 | U1.36 9.61,8.76 v9.53,8.76 | v20.3,11.89 23.35,11.89 C4.1 23.62,12.74 D1.C | C1.1 16.53,7.37 v17.25,6.65
  Bottom 0.254: v15.03,9.48 15.03,9.39 15.59,8.83 v15.59,7.57 15.59,5.07 11.76,1.24 11.01,1.24 9.27,2.99 9.27,3.31 7.86,4.72 7.81,4.72 | v17.25,6.65 21.04,6.65 U$2.VCC2 21.92,7.12 v21.92,8.45 | v7.73,4.72 7.81,4.72 | v6.71,3.63 7.81,4.72 | v4.96,6.6 U$2.VCC1 3.16,4.72 V+.P$1 | v6.6,7.87 7.48,8.75 | 7.48,8.75 7.48,8.76 v9.53,8.76 | 7.48,8.75 v7.62,8.75
VDDCORE
  Top 0.254: C2.1 10.13,3.87 12.24,5.98 L1.1 12.92,8.03 U1.41
VDDOUT
  Top 0.254: U1.43 13.94,7.68 L1.2
VLCD  (via drill 0.25)
  Top 0.254: C5.1 9.78,15.47 v10.36,15.47 | v12.2,14.81 13.18,14.81 13.43,15.07 U1.19
  Bottom 0.254: v10.36,15.47 11.49,15.47 12.15,14.81 v12.2,14.81
XIN32
  Top 0.152: U1.1 17.62,9.35 19.52,7.45 X1.P$1 19.6,7.45 20.12,6.93 C7.1
XOUT32
  Top 0.152: U1.2 X1.P$2 20.58,9.85 C6.1

### Text on the board
tPlace: 5V / D- / D+ / NC / GND | OSO-SWAT-A1-0x | Sensor Watch!
bPlace: USB / D- PA24 / D+ PA25 | REMOVE / BATTERY / BEFORE / USING / USB!!! | IMPORTANT: | LCD Segment Control / clock + symbols + 1 / digit in upper right, / via PA04-PA21 and / PB08-PB11. | Light Button: / PA03/I3 / Connects to / LED anode. | by joey castillo | The Sensor Watch | A watch mod for the Casio F-91W, based on Pluto / by CarrotIndustries, arm-watch by @GregDavill / and GoodWatch by @travisgoodspeed. / CC-BY-SA 4.0, except the bear. | 9-pin connector: / A0: PA02/I2 / SDA: PA22/SERCOM2 / SCL: PA23/SERCOM2 / A1: PB03/I3/TC2[1] / A2: PB02/I2/TC2[0] / D0: PB22/I6/TC3[0] / D1: PB23/I7/TC3[1] | Mode / PB23/I7 | Buzzer: / PA27/ / TCC[5]/ / GCLK[0] | Alarm / PB22/I6 | PB23